# Altium project Flyinh capacitor.PrjPCB
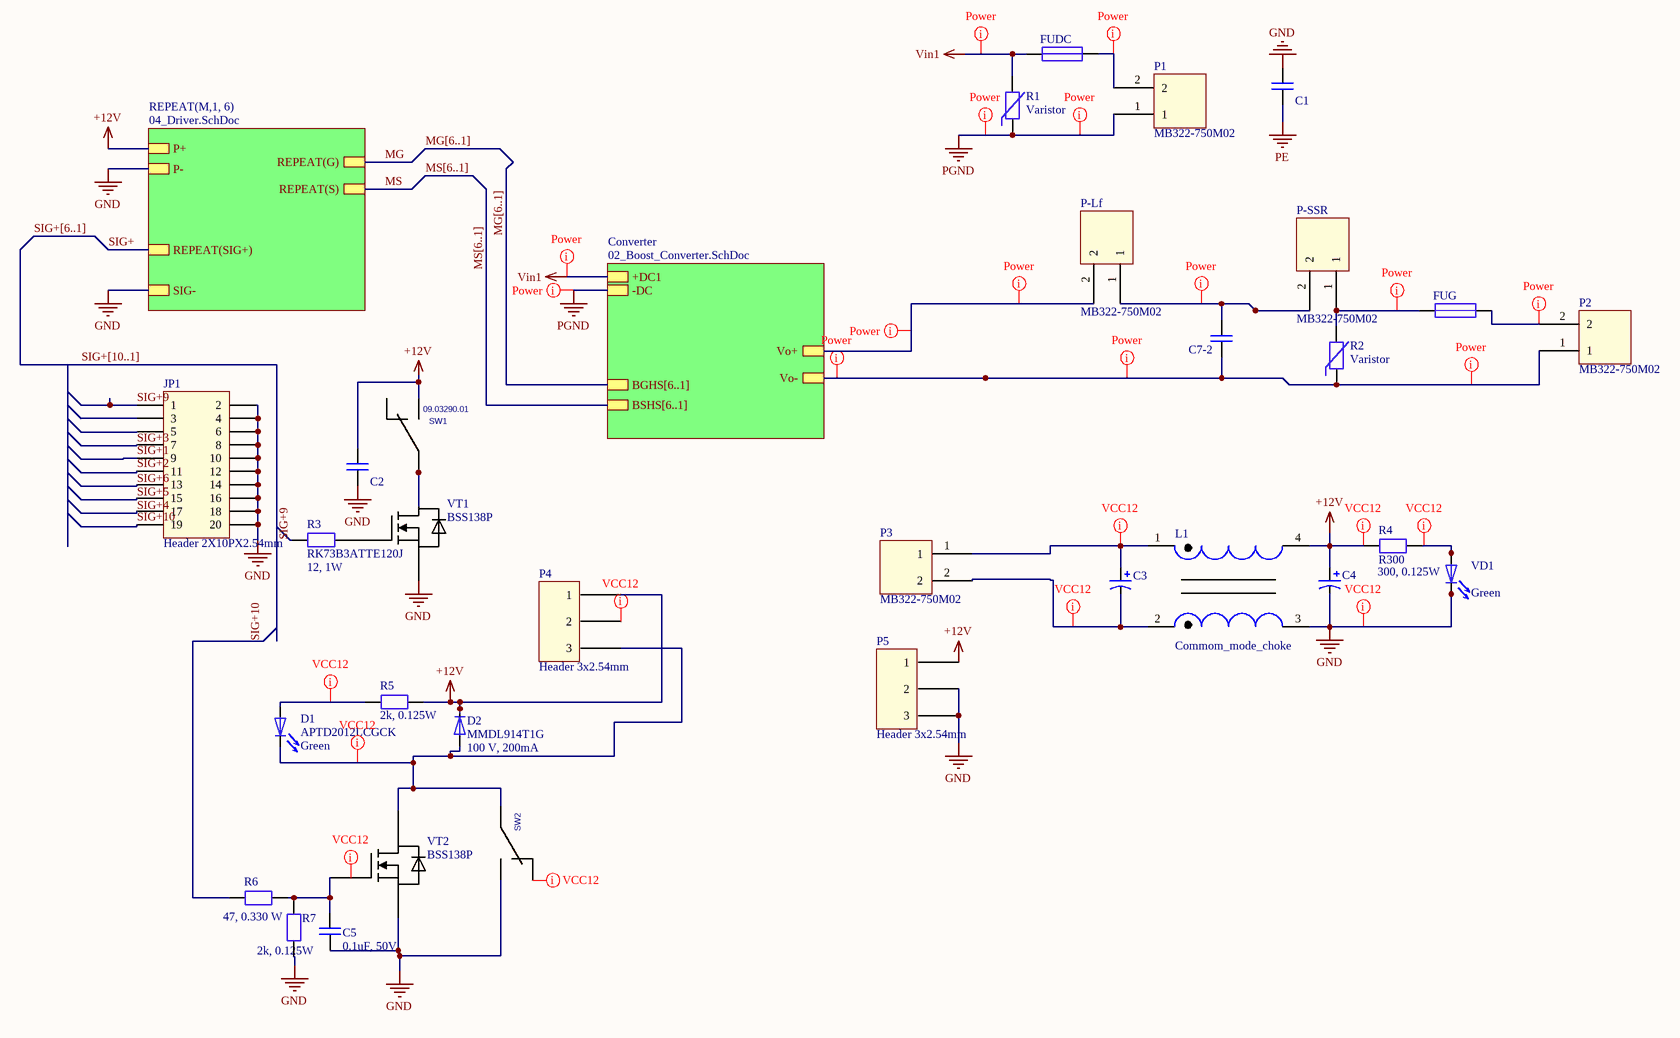
[diagram p0: 01_Main.SchDoc]
3 sheets, 145 parts. Net scope: hierarchical (ports join the sheet entries above them; power ports are global).
Board file: PCB1.PcbDoc
Sheets:
  01_Main.SchDoc
    M1 = 04_Driver.SchDoc
    M2 = 04_Driver.SchDoc
    M3 = 04_Driver.SchDoc
    M4 = 04_Driver.SchDoc
    M5 = 04_Driver.SchDoc
    M6 = 04_Driver.SchDoc
    Converter = 02_Boost_Converter.SchDoc

## Sheet 01_Main.SchDoc
size A3

### Parts
C1  Cer_large  [CAPC3227X25N]  (value not drawn)
C2  Cer_large  [CAPC3227X25N]  (value not drawn)
C3  NACEW102M25V12.5X14  [Cap_pol]  (value not drawn)
C4  NACEW102M25V12.5X14  [Cap_pol]  (value not drawn)
C5  0.1uF, 50V  [C_0805]
C7-2  C_ceram_HV  [C_ceram_HV]  (value not drawn)
D1  APTD2012LCGCK  value Green  [LED_SMD_0805]
D2  MMDL914T1G  value 100 V, 200mA  [SOD323F]
FUDC  Fuse 1  [Fuse5x20mm]  (value not drawn)
FUG  Fuse 1  [Fuse5x20mm]  (value not drawn)
JP1  Header 2X10PX2.54mm  [Header 2X10PX2.54mm]
L1  Commom_mode_choke  [Common_mode]
P1  MB322-750M02  [2_HOLES_7.5]
P2  MB322-750M02  [2_HOLES_7.5]
P3  MB322-750M02  [2_HOLES_7.5]
P4  Header 3x2.54mm  [3_HOLES]
P5  Header 3x2.54mm  [3_HOLES]
P-Lf  MB322-750M02  [2_HOLES_7.5]
P-SSR  MB322-750M02  [2_HOLES_7.5]
R1  Varistor  [Axial 0.2]
R2  Varistor  [Axial 0.2]
R3  RK73B3ATTE120J  value 12, 1W  [SMD_2512]
R4  R300  value 300, 0.125W  [SMD_2010]
R5  value 2k, 0.125W  [SMD_0805]  (hidden comment: 2k, 0.125W, 1%)
R6  47, 0.330 W  [SMD_0805]
R7  value 2k, 0.125W  [SMD_0805]  (hidden comment: 2k, 0.125W, 1%)
SW1  09.03290.01  [3_HOLES]
SW2  SWITCH3  [3_HOLES]  (value not drawn)
VD1  value Green  [LED_SMD_0805]  (hidden comment: APTD2012LCGCK)
VT1  BSS138P  [SOT65P210X110-3N]
VT2  BSS138P  [SOT65P210X110-3N]

### Sub-sheets
Converter = 02_Boost_Converter.SchDoc: +DC1, -DC, Vo+, Vo-, BSHS[6..1], BGHS[6..1]
REPEAT(M,1, 6) = 04_Driver.SchDoc: REPEAT(G), REPEAT(S), SIG-, REPEAT(SIG+), P-, P+

### Nets
+12V: C2.1 C4.1 D2.2 L1.4 P4.1 P5.1 R4.1 R5.1 SW1.3 ; sheet REPEAT(M,1, 6)/P+
GND: C1.1 C2.2 C4.2 C5.2 JP1.2 JP1.4 JP1.6 JP1.8 JP1.10 JP1.12 JP1.14 JP1.16 JP1.18 JP1.20 L1.3 P5.2 P5.3 R7.1 SW2.3 VD1.2 VT1.3(S) VT2.3(S) ; sheet REPEAT(M,1, 6)/SIG-, sheet REPEAT(M,1, 6)/P-
MS1: C7-2.2 P1.1 P2.1 R1.1 R2.1 ; sheet Converter/-DC, sheet Converter/Vo-  [also labelled MS3, PGND]
PE: C1.2
Vin1: FUDC.1 R1.2 ; sheet Converter/+DC1
MG: sheet REPEAT(M,1, 6)/REPEAT(G)
MS: sheet REPEAT(M,1, 6)/REPEAT(S)
MS6: P-Lf.2 ; sheet Converter/Vo+
SIG+: sheet REPEAT(M,1, 6)/REPEAT(SIG+)
SIG+1: JP1.9
SIG+2: JP1.11
SIG+3: JP1.7
SIG+4: JP1.17
SIG+5: JP1.15
SIG+6: JP1.13
SIG+9: JP1.1 R3.1
SIG+10: JP1.19 R6.1
NetC3_1: C3.1 L1.1 P3.1
NetC3_2: C3.2 L1.2 P3.2
NetC5_1: C5.1 R6.2 R7.2 VT2.1(G)
NetC7-2_1: C7-2.1 P-Lf.1 P-SSR.2
NetD1_1: D1.1 R5.2
NetD1_2: D1.2 D2.1 P4.3 SW2.2 VT2.2(D)
NetFUDC_2: FUDC.2 P1.2
NetFUG_1: FUG.1 P-SSR.1 R2.2
NetFUG_2: FUG.2 P2.2
NetR3_2: R3.2 VT1.1(G)
NetR4_2: R4.2 VD1.1
NetSW1_1: SW1.1 VT1.2(D)

Not connected (* = marked no-connect by the designer): JP1 3 5; P4 2; SW1 2; SW2 1

### Buses and harness runs
bus MG[6..1]
bus MG[6..1] = sheet Converter/BGHS[6..1]
bus MS[6..1]
bus MS[6..1] = sheet Converter/BSHS[6..1]
bus SIG+[6..1]
bus SIG+[10..1]

### Layout directives
net class +12: (no net found under the mark), +12V, GND, NetC3_1, NetC3_2, NetD1_1, NetD1_2, NetP4_2, NetR4_2, NetSW2_1
net class Power: MS1, MS6, NetC7-2_1, NetFUDC_2, NetFUG_1, NetFUG_2, Vin1

### Library data of the parts
C1 C2 = Cer_large: Order code: 1759466; Value: 22mkF; Type: 16V; Supplier: Farnel; Price: 0.407; Package: 1210
C3 C4 = NACEW102M25V12.5X14: Value: 1 mF; Type: 25V; Order code: 16731346; Supplier: Elfa; Price: 3,28
C5 = Cap_UMF212B7104KGHT: 0.1uF, 50V, MLCC; Manufacturer: Taiyo Yuden; Order code: 963-UMF212B7104KGHT; Supplier: Mouser; Price: 0,198; Type: MLCC; Package: smd 0805; PartNumber: UMF212B7104KGHT; value: 0.1uF, 50V
D1 VD1 = LED_APTD2012LCGCK: Green LED, 0805; Manufacturer: Kingbright; order code: 604-APTD2012LCGCK; Type: Standard LEDs - SMD; Price: 0,378; Supplier: Mouser; PartNumber: APTD2012LCGCK; Package: smd 0805
D2 = Diode_MMDL914T1G: 100 V, 200mA, Diodes; Manufacturer: ON Semiconductor; Order code: 863-MMDL914T1G; Type: Diodes; Supplier: Mouser; Package: SOD-323; Price: 0,099; PartNumber: MMDL914T1G
FUDC FUG = Fuse 1: Manufacturer: Schurter; Value: Fuse 5x20; Order code: 33-173-75, 33-160-31, 33-161-63; Type: 16A; Price: 0,48; 0,54; 0,45; Supplier: Elfa; Package: Fuse 5x20
JP1 = Header 2X10PX2.54mm: 2x10x2.54mm, Shrouded; Manufacturer: Amphenol FCI; PartNumber: 52601-S20-6LF; Order code: 649-52601-S20-6LF; Package: 2x10x2.54mm; Price: 1,68; Publisher: *; Supplier: Mouser; Type: Shrouded; Value: 2x10x2.54mm; Header 2X10PX2.54mm: *
L1 = Commom_mode_choke: Manufacturer: Wьrth Elektronik; Type: Common mode choke; Value: 20 mH 0.5 A; Order code: 15857854; Supplier: Elfa; Package: Trough_hole; Price: 4,54
P1-P3 P-Lf P-SSR = MB322-750M02: Value: 2 poles, 16A, 750V; Order code: 48-397-07; Type: MB322-750M02; Manufacturer: *; Supplier: Elfa; Package: 7.5 mm; Price: 0.43
P4 P5 = Header_3-Pin_281695-3: 3x2.54mm, Headers & Wire Housings; Manufacturer: TE Connectivity / AMP; Order code: 571-281695-3; Type: Headers & Wire Housings; Value: 3x2.54mm; Package: 3x2.54mm; Supplier: Mouser; Price: 0,52; PartNumber: 281695-3
R1 R2 = Varistor: Manufacturer: EPCOS; Value: 615V; Order code: 60-307-55; Type: Res Var; Supplier: Elfa; Price: 0,38; Package: 48X8X6 mm
R3 = RK73B3ATTE120J: Manufacturer: KOA; Order code: 60-205-98; Type: 200V, 5%; Supplier: Elfa; Price: 0,144; Package: smd 2512
R5 R7 = Res_CRCW08052K00FKEAC: 2k, 0.125W, 1%, 0805, Thick Film Resistors; Manufacturer: Vishay; Order code: 71-CRCW08052K00FKEAC; Price: 0,097; Supplier: Mouser; datasheet: https://www1.elfa.se/data1/wwwroot/assets/datasheets/06016752.pdf; Type: Thick Film Resistors; Package: smd 0805; PartNumber: CRCW08052K00FKEAC
R6 = RK73H2ATTD47R0F: 47, 0.330 W, 0805, Thick Film Resistors; Manufacturer: TE Connectivity / Holsworthy; Order code: 279-CRGH0805F47R; Price: 0,09; Supplier: Mouser; datasheet: https://www1.elfa.se/data1/wwwroot/assets/datasheets/06016752.pdf; Type: Thick Film Resistors - SMD; Package: smd 0805; PartNumber: RK73H2ATTD47R0F; Value: 47, 0.330 W
SW1 = SW_09.03290.01: 12 VDC, Slide Switches; Manufacturer: EAO; Value: 12 VDC; Order code: 123-09.03290.01; datasheet: https://www1.elfa.se/data1/wwwroot/assets/datasheets/03536521.pdf; Price: 1,43; Supplier: Mouser; Package: 3x2,54; Type: Slide Switches; PartNumber: 09.03290.01
SW2 = SWITCH3: Manufacture: EAO; Order code: 3536547; Value: *; datasheet: https://www1.elfa.se/data1/wwwroot/assets/datasheets/03536521.pdf; Price: 1,59; Supplier: Elfa; Package: 3x2,54; Publisher: *; Type: Jumper
VT1 VT2 = BSS138P: Manufacturer: Nexperia; Type: APT77N60SC6; Value: 60V, 1Ohm; Package: SOT23; Publisher: *; Supplier: mouser
R4 = R300: Type: 16V, 1%; Package: smd 2010; Price: *; Supplier: *; Order code: *; Manufacturer: *

## Sheet 04_Driver.SchDoc: Driver Cirquit
size A4
Used 6 times, as channels M1, M2, M3, M4, M5, M6. Parts and nets are listed once, with the designators drawn on the sheet.
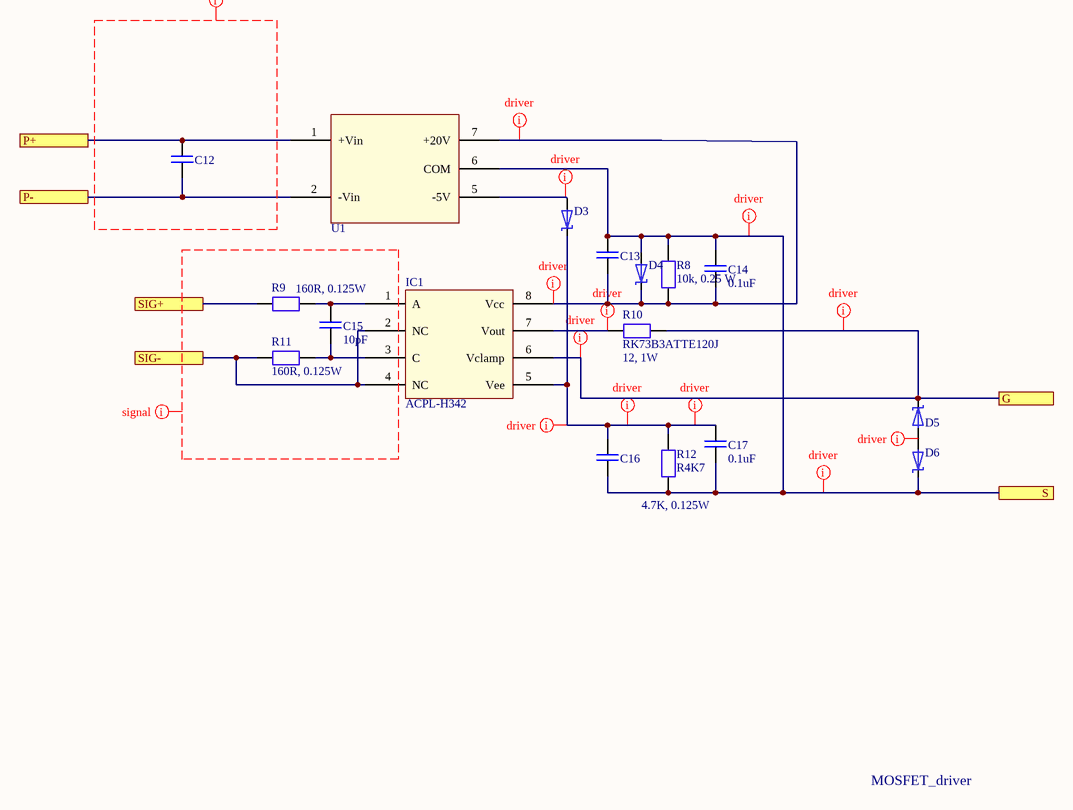
[diagram p1: 04_Driver.SchDoc]

### Parts
C12  Cer_large  [CAPC3227X25N]  (value not drawn)
C13  Cer_large  [CAPC3227X25N]  (value not drawn)
C14  value 0.1uF  [C_0805]  (hidden comment: C0805C104K5RAC)
C15  value 10pF  [C_0805]  (hidden comment: C0805C100J1GAC)
C16  Cer_large  [CAPC3227X25N]  (value not drawn)
C17  value 0.1uF  [C_0805]  (hidden comment: C0805C104K5RAC)
D3  Zener_1.8V  [SOD123]  (value not drawn)
D4  DZ2J220M0L  [SOD323F]  (value not drawn)
D5  MMSZ4678T1G  [CAPM3216X18N]  (value not drawn)
D6  MMSZ4678T1G  [CAPM3216X18N]  (value not drawn)
IC1  ACPL-H342  [SOIC127P970X330-8N]
R8  value 10k, 0.25 W  [SMD_1206]  (hidden comment: RK73H2BTTD1002F)
R9  value 160R, 0.125W  [SMD_0805]  (hidden comment: RK73H2ATTD1600F)
R10  RK73B3ATTE120J  value 12, 1W  [SMD_2512]
R11  value 160R, 0.125W  [SMD_0805]  (hidden comment: RK73H2ATTD1600F)
R12  R4K7  value 4.7K, 0.125W  [smd_0603]
U1  MGJ2D242005SC  [MGJ2]  (value not drawn)

### Ports
G, P+, P-, S, SIG+, SIG-

### Nets
G: D5.1 IC1.6(Vclamp) R10.2 ; port G
P+: C12.1 U1.1(+Vin) ; port P+
P-: C12.2 U1.2(-Vin) ; port P-
S: C13.1 C14.1 C16.2 C17.2 D4.1 D6.1 R8.2 R12.1 U1.6(COM) ; port S
SIG+: R9.1 ; port SIG+
SIG-: IC1.2(NC) IC1.4(NC) R11.1 ; port SIG-
NetC13_2: C13.2 C14.2 D4.2 IC1.8(Vcc) R8.1 U1.7(+20V)
NetC15_1: C15.1 IC1.1(A) R9.2
NetC15_2: C15.2 IC1.3(C) R11.2
NetC16_1: C16.1 C17.1 D3.2 IC1.5(Vee) R12.2
NetD3_1: D3.1 U1.5(-5V)
NetD5_2: D5.2 D6.2
NetIC1_7: IC1.7(Vout) R10.1

### Channels
M1: designators end in _M1; ports G=G1 P+=+12V P-=GND S=MS1 SIG+=SIG+1 SIG-=GND
M2: designators end in _M2; ports G=G2 P+=+12V P-=GND S=MS2 SIG+=SIG+2 SIG-=GND
M3: designators end in _M3; ports G=G3 P+=+12V P-=GND S=MS1 SIG+=SIG+3 SIG-=GND
M4: designators end in _M4; ports G=G4 P+=+12V P-=GND S=MS4 SIG+=SIG+4 SIG-=GND
M5: designators end in _M5; ports G=G5 P+=+12V P-=GND S=MS4 SIG+=SIG+5 SIG-=GND
M6: designators end in _M6; ports G=G6 P+=+12V P-=GND S=MS6 SIG+=SIG+6 SIG-=GND

### Layout directives
net class Driver: G1, MS1, NetC13_M1_2, NetC16_M1_1, NetD3_M1_1, NetD5_M1_2, NetIC1_M1_7
net class Signal: (no net found under the mark)

### Notes on the sheet
- MOSFET_driver

### Library data of the parts
C12 C13 C16 = Cer_large: as C1 on sheet 01_Main; Supplier: Farnel; Price: 0.407; Package: 1210
C14 C17 = C0805C104K5RAC: 0.1u, 50V; Manufacturer: Kemet; Order code: 6576631; Supplier: Elfa; Price: 0,06; Type: C0805C104K5RAC; Package: smd 0805
C15 = C0805C100J1GAC: 10p, 100V; Manufacturer: Kemet; Order code: 6576805; Supplier: Elfa; Price: 0,266; Type: C0805C100J1GAC; Package: smd 0805
D3 = Zener_1.8V: Zener diode; Type: 0.5W; Value: 1.8V; Order code: 1459115; Supplier: Farnell; Price: 0.172; Package: SOD-123
D4 = DZ2J220M0L: Type: Zener diode; Value: 22V, 200mW; Order code: 2285315; Package: SOD323F; Supplier: Farnel; Price: 0.041
D5 D6 = Zener_MMSZ5233BT1G: 6V, 500mW, Zener Diodes; Manufacturer: ON Semiconductor; Order code: 863-MMSZ5233BT1G; Supplier: Mouser; Price: 0,18; Package: SOD-123-2; Type: Zener Diodes; PartNumber: MMSZ5233BT1G; Value: 6V, 500mW
IC1 = ACPL-H342: Manufacturer: Avago; Order code: 1833408; Value: 2,5 A, 12-30V; Package: SSO-8; Price: 2; Publisher: *; Supplier: Farnell; Type: ACPL-H342
R8 = RK73H2BTTD1002F: 10k, 0.25 W; Manufacturer: KOA; Order code: 6019731; Price: 0,111; Supplier: Elfa; datasheet: https://www1.elfa.se/data1/wwwroot/assets/datasheets/06016752.pdf; Type: RK73H2BTTD1002F; Package: smd 1206
R9 R11 = RK73H2ATTD1600F: 160R, 0.125W; Manufacturer: KOA; Order code: 60-173-05; Type: 1%, 150V; Price: 0.097; Package: smd 0805; Supplier: Elfa
R10 = RK73B3ATTE120J: Manufacturer: KOA; Order code: 60-205-98; Type: 200V, 5%; Supplier: Elfa; Price: 0,144; Package: smd 2512
R12 = R4K7: Order code: 9332154; Type: 16V, 1%; Package: smd 0603; Manufacturer: *; Supplier: Farnel; Price: 0.01
U1 = MGJ2D242005SC: Value: 2W; Order code: 2420071; Type: 12V/20V/-5V; Supplier: Farnell; Package: 7dip; Price: 7.49

## Sheet 02_Boost_Converter.SchDoc
size A2
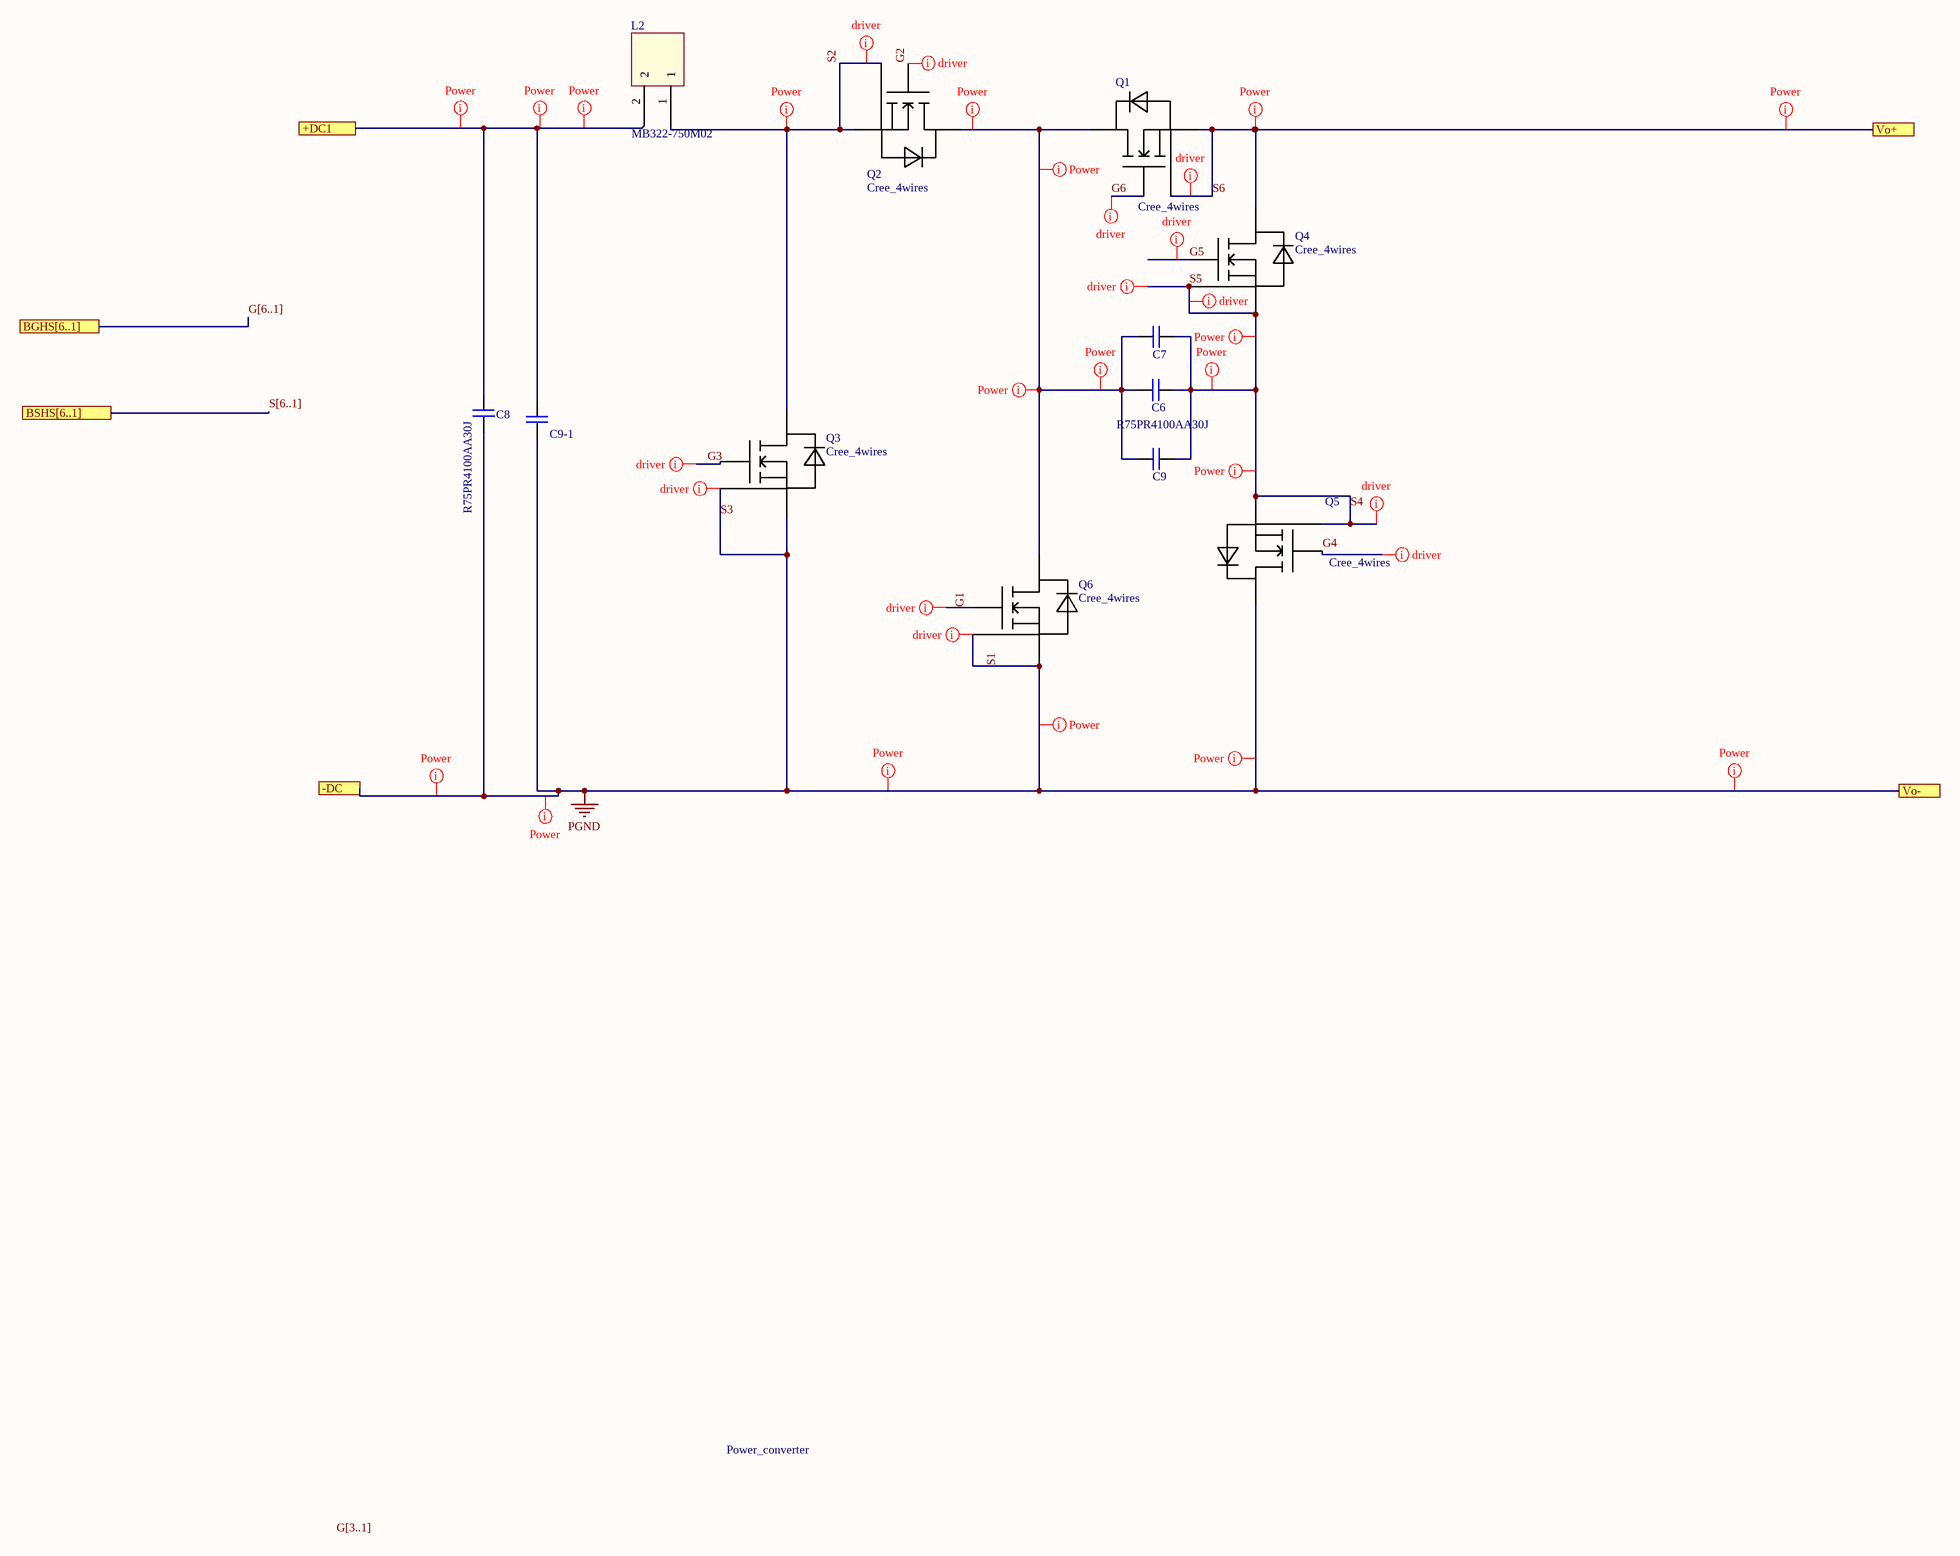
[diagram p2: 02_Boost_Converter.SchDoc]

### Parts
C6  R75PR4100AA30J  [CAP_6]
C7  C_ceram_HV  [CAP_250V]  (value not drawn)
C8  R75PR4100AA30J  [32x22]
C9  C_ceram_HV  [CAP_250V]  (value not drawn)
C9-1  C_ceram_HV  [C_ceram_HV]  (value not drawn)
L2  MB322-750M02  [2_HOLES_7.5]
Q1  Cree_4wires  [VT4_SicMosfet]
Q2  Cree_4wires  [VT4_SicMosfet]
Q3  Cree_4wires  [VT4_SicMosfet]
Q4  Cree_4wires  [VT4_SicMosfet]
Q5  Cree_4wires  [VT4_SicMosfet]
Q6  Cree_4wires  [VT4_SicMosfet]

### Ports
+DC1, -DC, BGHS[6..1], BSHS[6..1], Vo+, Vo-

### Nets
PGND: C8.2 C9-1.2 Q3.2(S) Q3.3(SG) Q5.1(D) Q6.2(S) Q6.3(SG) ; port Vo-, port -DC  [also labelled S1, S3]  [project net MS1]
Vin1: C8.1 C9-1.1 L2.2 ; port +DC1
G1: Q6.4(G)
G2: Q2.4(G)
G3: Q3.4(G)
G4: Q5.4(G)
G5: Q4.4(G)
G6: Q1.4(G)
S2: L2.1 Q2.2(S) Q2.3(SG) Q3.1(D)  [project net MS2]
S4: C6.2 C7.2 C9.2 Q4.2(S) Q4.3(SG) Q5.2(S) Q5.3(SG)  [also labelled S5]  [project net MS4]
S6: Q1.2(S) Q1.3(SG) Q4.1(D) ; port Vo+  [project net MS6]
NetC6_1: C6.1 C7.1 C9.1 Q1.1(D) Q2.1(D) Q6.1(D)

### Buses and harness runs
bus G[3..1]
bus G[6..1] = port BGHS[6..1]
bus S[6..1] = port BSHS[6..1]

### Layout directives
net class Power: (no net found under the mark), MS1, MS2, MS4, MS6, NetC6_1, Vin1
net class Driver: G1, G2, G3, G4, G5, G6, MS1, MS2, MS4, MS6

### Notes on the sheet
- Power_converter
- Labels drawn without touching a wire or pin: G[3..1]

### Library data of the parts
C6 = C_ceram_HV
L2 = MB322-750M02: as P1 on sheet 01_Main; Type: MB322-750M02; Manufacturer: *; Supplier: Elfa; Package: 7.5 mm; Price: 0.43

## Nets that join several sheets
+12V: 01_Main (9 pins), M1 (C12_M1.1 U1_M1.1), M2 (C12_M2.1 U1_M2.1), M3 (C12_M3.1 U1_M3.1), M4 (C12_M4.1 U1_M4.1), M5 (C12_M5.1 U1_M5.1), M6 (C12_M6.1 U1_M6.1)
GND: 01_Main (22 pins), M1 (5 pins), M2 (5 pins), M3 (5 pins), M4 (5 pins), M5 (5 pins), M6 (5 pins)
MS1: 01_Main (5 pins), M1 (9 pins), M3 (9 pins), 02_Boost_Converter (7 pins)
Vin1: 01_Main (FUDC.1 R1.2), 02_Boost_Converter (C8.1 C9-1.1 L2.2)
G1: M1 (D5_M1.1 IC1_M1.6 R10_M1.2), 02_Boost_Converter (Q6.4)
G2: M2 (D5_M2.1 IC1_M2.6 R10_M2.2), 02_Boost_Converter (Q2.4)
G3: M3 (D5_M3.1 IC1_M3.6 R10_M3.2), 02_Boost_Converter (Q3.4)
G4: M4 (D5_M4.1 IC1_M4.6 R10_M4.2), 02_Boost_Converter (Q5.4)
G5: M5 (D5_M5.1 IC1_M5.6 R10_M5.2), 02_Boost_Converter (Q4.4)
G6: M6 (D5_M6.1 IC1_M6.6 R10_M6.2), 02_Boost_Converter (Q1.4)
MS2: M2 (9 pins), 02_Boost_Converter (L2.1 Q2.2 Q2.3 Q3.1)
MS4: M4 (9 pins), M5 (9 pins), 02_Boost_Converter (7 pins)
MS6: 01_Main (P-Lf.2), M6 (9 pins), 02_Boost_Converter (Q1.2 Q1.3 Q4.1)
SIG+1: 01_Main (JP1.9), M1 (R9_M1.1)
SIG+2: 01_Main (JP1.11), M2 (R9_M2.1)
SIG+3: 01_Main (JP1.7), M3 (R9_M3.1)
SIG+4: 01_Main (JP1.17), M4 (R9_M4.1)
SIG+5: 01_Main (JP1.15), M5 (R9_M5.1)
SIG+6: 01_Main (JP1.13), M6 (R9_M6.1)